# Altium schematic sheet Voltage Source.SchDoc: Voltage Source
size A4; Author: DO DANH LUONG; Revision: 1.0; SheetNumber: 3; SheetTotal: 6
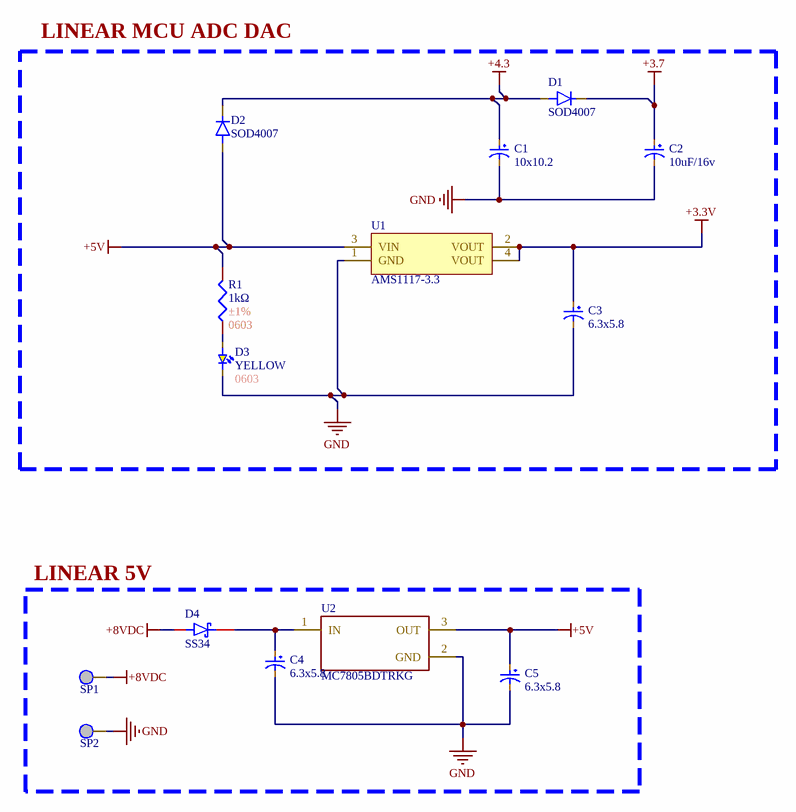
[diagram p0: Voltage Source.SchDoc]

## Parts
C1  10x10.2  [C_10x10.2mm_Aluminum_SMD]
C2  10uF/16v  [C_4.3x5_Aluminum_smd]
C3  6.3x5.8  [C_6.3x5.8mm_Aluminum_SMD]
C4  6.3x5.8  [C_6.3x5.8mm_Aluminum_SMD]
C5  6.3x5.8  [C_6.3x5.8mm_Aluminum_SMD]
D1  SOD4007  [SOD4007]
D2  SOD4007  [SOD4007]
D3  YELLOW  Package: 0603  [LED0603]
D4  SS34  [SS34]
R1  1kΩ  Tolerance: ±1%  Package: 0603  [R0603]
SP1  SP  [SP]  (value not drawn)
SP2  SP  [SP]  (value not drawn)
U1  AMS1117-3.3  [AMS1117-3.3]
U2  MC7805BDTRKG  [7805]

## Blocks framed on the sheet
LINEAR MCU ADC DAC: C1-C3 D1-D3 R1 U1
LINEAR 5V: C4 C5 D4 SP1 SP2 U2

## Nets
+3.3V: C3.1 U1.2(VOUT) U1.4(VOUT)
+3.7: C2.1 D1.1(C)
+4.3: C1.1 D1.2(A) D2.1(C)
+5V: C5.1 D2.2(A) R1.2 U1.3(VIN) U2.3(OUT)
+8VDC: D4.2 SP1.1
GND: C1.2 C2.2 C3.2 C4.2 C5.2 D3.1 SP2.1 U1.1(GND) U2.2(GND)
NetC4_1: C4.1 D4.1 U2.1(IN)
NetD3_2: D3.2 R1.1

## Notes on the sheet
- Author:
- Title:
- Size:
- A4
- Project:
- Approved:
- Revision:
- Modified Date:
- CONFIDENTIAL
- Date:
- SW Version:

## Library data of the parts
C1 = C_10x10.2_Aluminum_SMD: 1000uF 16V ±20% 347mA@120Hz SMD,D10xL10.2mm Aluminum Electrolytic Capacitors RoHS; Manufacturer: ROQANG; Mfr. Part #: RVT1C102M1010; LCSC Part #: C72470; Link: https://www.lcsc.com/product-detail/C72470.html
C2 = C_4.3x5_Aluminum_SMD: 10ÂµF 16V Aluminum Electrolytic Capacitors Radial, Can - SMD 2000 Hrs @ 105Â°C; MP: EEE-HB1C100R; MF: Panasonic Electronic; Price: None; Check_prices: https://www.snapeda.com/parts/EEE-HB1C100R/Panasonic%20Electronic%20Components/view-part/605830/?ref=eda; Value: *; Purchase-URL: https://pricing.snapeda.com/search/part/EEE-HB1C100R/?ref=eda; Package: RADIAL-2 Panasonic; SnapEDA_Link: https://www.snapeda.com/parts/EEE-HB1C100R/Panasonic%20Electronic%20Components/view-part/605830/?ref=snap; Availability: In Stock
C3-C5 = C_6.3x5.8_Aluminum_SMD: 16V 10uF ±20% SMD,D6.3xL5.8mm Aluminum - Polymer Capacitors RoHS; Manufacturer: Honor Elec; Mfr. Part #: HV1C106M0605PZ; LCSC Part #: C5246522; Link: https://www.lcsc.com/product-detail/C5246522.html
D1 D2 = SOD4007: 1A Independent 1kV 1.1V@1A SOD-123FL Diodes - General Purpose ROHS; Manufacturer: MDD(Microdiode Semiconductor); Mfr. Part #: SOD4007; Package: SOD-123FL; LCSC Part #: C18124; Link: https://www.lcsc.com/product-detail/C18124.html?s_z=n_SOD4007; Voltage - DC Reverse(Vr): 1kV; Current - Rectified: 1A
D3 = D0603_YELLOW: 25mcd~40mcd Water Clear -40℃~+85℃ 624nm Red 120° 60mW 0402 LED Indication - Discrete ROHS; Manufacturer: XINGLIGHT; Mfr. Part #: XL-1005UGC; Voltage - Forward(Vf): 3V; LCSC Part #: C965793; Power(Watts): 60mW; Link: https://www.lcsc.com/product-detail/C136765.html?s_z=n_LED%25200402%2520RED; Illumination Color: YELLOW
D4 = SS34: 40V Independent 3A 550mV@3A SMA(DO-214AC) Schottky Diodes ROHS; Manufacturer: MDD(Microdiode Semiconductor); Mfr. Part #: SS34; LCSC Part #: C8678; Package: SMA(DO-214AC); Voltage - DC Reverse(Vr): 40V; Current - Rectified: 3A; Link: https://www.lcsc.com/product-detail/C8678.html?s_z=n_SS34
R1 = R0603_1kΩ_±1%: 62.5mW Thick Film Resistor 50V ±1% ±200ppm/℃ 10Ω 0402 Chip Resistor - Surface Mount ROHS; Manufacturer: YAGEO; Mfr. Part #: RC0402FR-0710RL; LCSC Part #: C138066; Resistance: 1kΩ; Link: https://www.lcsc.com/product-detail/C138066.html?s_z=n_resistor%25200402%252010R
U1 = AMS1117-3.3: 72dB@(120Hz) 1A Fixed 3.3V Positive 16V SOT-223 Voltage Regulators - Linear, Low Drop Out (LDO) Regulators ROHS; Manufacturer: Advanced Monolithic Systems; LCSC Part #: C6186; Link: https://www.lcsc.com/product-detail/C6186.html?s_z=n_ams1117-3.3; Output Current: 1A; Package: SOT-223; Mfr. Part #: AMS1117-3.3
U2 = 7805: 68dB@(120Hz) 1A Fixed 5V Positive 24V TO-252-2(DPAK) Voltage Regulators - Linear, Low Drop Out (LDO) Regulators ROHS; Manufacturer: onsemi; Mfr. Part #: MC7805BDTRKG; LCSC Part #: C110908; Package: TO-252-2(DPAK); Output Current: 1A; Output Voltage: 5V; Voltage - Supply: 24V; Link: https://www.lcsc.com/product-detail/C110908.html?s_z=n_7805